# EAGLE design ten_peg_board (EAGLE 9.3.0)
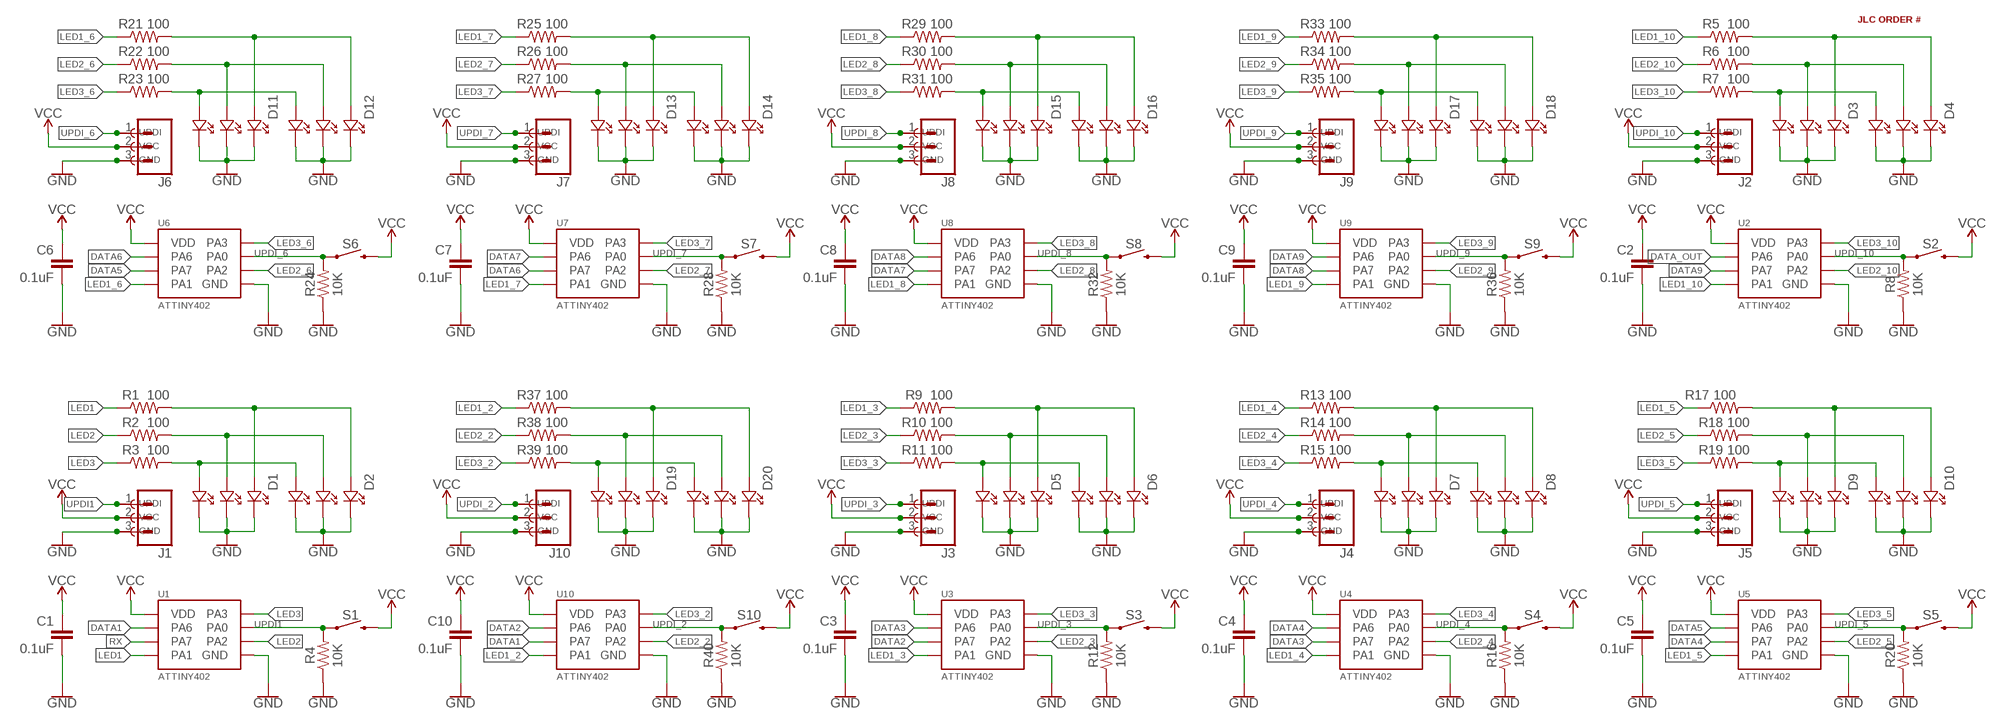
[diagram p0: schematic, sheet 1]

## Parts
C1  0.1uF  0.1UF-0603-25V-(+80/-20%)  [0603]
C2  0.1uF  0.1UF-0603-25V-(+80/-20%)  [0603]
C3  0.1uF  0.1UF-0603-25V-(+80/-20%)  [0603]
C4  0.1uF  0.1UF-0603-25V-(+80/-20%)  [0603]
C5  0.1uF  0.1UF-0603-25V-(+80/-20%)  [0603]
C6  0.1uF  0.1UF-0603-25V-(+80/-20%)  [0603]
C7  0.1uF  0.1UF-0603-25V-(+80/-20%)  [0603]
C8  0.1uF  0.1UF-0603-25V-(+80/-20%)  [0603]
C9  0.1uF  0.1UF-0603-25V-(+80/-20%)  [0603]
C10  0.1uF  0.1UF-0603-25V-(+80/-20%)  [0603]
D1  19-337C/RSBHGHC-A88/4T  [6-SMD]
D2  19-337C/RSBHGHC-A88/4T  [6-SMD]
D3  19-337C/RSBHGHC-A88/4T  [6-SMD]
D4  19-337C/RSBHGHC-A88/4T  [6-SMD]
D5  19-337C/RSBHGHC-A88/4T  [6-SMD]
D6  19-337C/RSBHGHC-A88/4T  [6-SMD]
D7  19-337C/RSBHGHC-A88/4T  [6-SMD]
D8  19-337C/RSBHGHC-A88/4T  [6-SMD]
D9  19-337C/RSBHGHC-A88/4T  [6-SMD]
D10  19-337C/RSBHGHC-A88/4T  [6-SMD]
D11  19-337C/RSBHGHC-A88/4T  [6-SMD]
D12  19-337C/RSBHGHC-A88/4T  [6-SMD]
D13  19-337C/RSBHGHC-A88/4T  [6-SMD]
D14  19-337C/RSBHGHC-A88/4T  [6-SMD]
D15  19-337C/RSBHGHC-A88/4T  [6-SMD]
D16  19-337C/RSBHGHC-A88/4T  [6-SMD]
D17  19-337C/RSBHGHC-A88/4T  [6-SMD]
D18  19-337C/RSBHGHC-A88/4T  [6-SMD]
D19  19-337C/RSBHGHC-A88/4T  [6-SMD]
D20  19-337C/RSBHGHC-A88/4T  [6-SMD]
J1  CONN_03LOCK_LONGPADS  [1X03_LOCK_LONGPADS]
J2  CONN_03LOCK_LONGPADS  [1X03_LOCK_LONGPADS]
J3  CONN_03LOCK_LONGPADS  [1X03_LOCK_LONGPADS]
J4  CONN_03LOCK_LONGPADS  [1X03_LOCK_LONGPADS]
J5  CONN_03LOCK_LONGPADS  [1X03_LOCK_LONGPADS]
J6  CONN_03LOCK_LONGPADS  [1X03_LOCK_LONGPADS]
J7  CONN_03LOCK_LONGPADS  [1X03_LOCK_LONGPADS]
J8  CONN_03LOCK_LONGPADS  [1X03_LOCK_LONGPADS]
J9  CONN_03LOCK_LONGPADS  [1X03_LOCK_LONGPADS]
J10  CONN_03LOCK_LONGPADS  [1X03_LOCK_LONGPADS]
R1  100  100OHM-0603-1/4W-5%  [0603]
R2  100  100OHM-0603-1/4W-5%  [0603]
R3  100  100OHM-0603-1/4W-5%  [0603]
R4  10K  100OHM-0603-1/4W-5%  [0603]
R5  100  100OHM-0603-1/4W-5%  [0603]
R6  100  100OHM-0603-1/4W-5%  [0603]
R7  100  100OHM-0603-1/4W-5%  [0603]
R8  10K  100OHM-0603-1/4W-5%  [0603]
R9  100  100OHM-0603-1/4W-5%  [0603]
R10  100  100OHM-0603-1/4W-5%  [0603]
R11  100  100OHM-0603-1/4W-5%  [0603]
R12  10K  100OHM-0603-1/4W-5%  [0603]
R13  100  100OHM-0603-1/4W-5%  [0603]
R14  100  100OHM-0603-1/4W-5%  [0603]
R15  100  100OHM-0603-1/4W-5%  [0603]
R16  10K  100OHM-0603-1/4W-5%  [0603]
R17  100  100OHM-0603-1/4W-5%  [0603]
R18  100  100OHM-0603-1/4W-5%  [0603]
R19  100  100OHM-0603-1/4W-5%  [0603]
R20  10K  100OHM-0603-1/4W-5%  [0603]
R21  100  100OHM-0603-1/4W-5%  [0603]
R22  100  100OHM-0603-1/4W-5%  [0603]
R23  100  100OHM-0603-1/4W-5%  [0603]
R24  10K  100OHM-0603-1/4W-5%  [0603]
R25  100  100OHM-0603-1/4W-5%  [0603]
R26  100  100OHM-0603-1/4W-5%  [0603]
R27  100  100OHM-0603-1/4W-5%  [0603]
R28  10K  100OHM-0603-1/4W-5%  [0603]
R29  100  100OHM-0603-1/4W-5%  [0603]
R30  100  100OHM-0603-1/4W-5%  [0603]
R31  100  100OHM-0603-1/4W-5%  [0603]
R32  10K  100OHM-0603-1/4W-5%  [0603]
R33  100  100OHM-0603-1/4W-5%  [0603]
R34  100  100OHM-0603-1/4W-5%  [0603]
R35  100  100OHM-0603-1/4W-5%  [0603]
R36  10K  100OHM-0603-1/4W-5%  [0603]
R37  100  100OHM-0603-1/4W-5%  [0603]
R38  100  100OHM-0603-1/4W-5%  [0603]
R39  100  100OHM-0603-1/4W-5%  [0603]
R40  10K  100OHM-0603-1/4W-5%  [0603]
S1  MOMENTARY-SWITCH-SPST-SMD-4.5MM-WINGED  [TACTILE_SWITCH_SMD_4.5MM_WINGED]
S2  MOMENTARY-SWITCH-SPST-SMD-4.5MM-WINGED  [TACTILE_SWITCH_SMD_4.5MM_WINGED]
S3  MOMENTARY-SWITCH-SPST-SMD-4.5MM-WINGED  [TACTILE_SWITCH_SMD_4.5MM_WINGED]
S4  MOMENTARY-SWITCH-SPST-SMD-4.5MM-WINGED  [TACTILE_SWITCH_SMD_4.5MM_WINGED]
S5  MOMENTARY-SWITCH-SPST-SMD-4.5MM-WINGED  [TACTILE_SWITCH_SMD_4.5MM_WINGED]
S6  MOMENTARY-SWITCH-SPST-SMD-4.5MM-WINGED  [TACTILE_SWITCH_SMD_4.5MM_WINGED]
S7  MOMENTARY-SWITCH-SPST-SMD-4.5MM-WINGED  [TACTILE_SWITCH_SMD_4.5MM_WINGED]
S8  MOMENTARY-SWITCH-SPST-SMD-4.5MM-WINGED  [TACTILE_SWITCH_SMD_4.5MM_WINGED]
S9  MOMENTARY-SWITCH-SPST-SMD-4.5MM-WINGED  [TACTILE_SWITCH_SMD_4.5MM_WINGED]
S10  MOMENTARY-SWITCH-SPST-SMD-4.5MM-WINGED  [TACTILE_SWITCH_SMD_4.5MM_WINGED]
TP1  TEST-POINT3X5  [PAD.03X.05]
TP2  TEST-POINT3X5  [PAD.03X.05]
TP3  TEST-POINT3X5  [PAD.03X.05]
TP4  TEST-POINT3X5  [PAD.03X.05]
TP5  TEST-POINT3X5  [PAD.03X.05]
TP6  TEST-POINT3X5  [PAD.03X.05]
TP7  TEST-POINT3X5  [PAD.03X.05]
TP8  TEST-POINT3X5  [PAD.03X.05]
TP9  TEST-POINT3X5  [PAD.03X.05]
TP10  TEST-POINT3X5  [PAD.03X.05]
TP11  TEST-POINT3X5  [PAD.03X.05]
TP12  TEST-POINT3X5  [PAD.03X.05]
TP13  TEST-POINT3X5  [PAD.03X.05]
TP14  TEST-POINT3X5  [PAD.03X.05]
TP15  TEST-POINT3X5  [PAD.03X.05]
TP16  TEST-POINT3X5  [PAD.03X.05]
TP17  TEST-POINT3X5  [PAD.03X.05]
TP18  TEST-POINT3X5  [PAD.03X.05]
TP19  TEST-POINT3X5  [PAD.03X.05]
TP20  TEST-POINT3X5  [PAD.03X.05]
TP21  TEST-POINT3X5  [PAD.03X.05]
TP22  TEST-POINT3X5  [PAD.03X.05]
TP23  TEST-POINT3X5  [PAD.03X.05]
TP24  TEST-POINT3X5  [PAD.03X.05]
TP25  TEST-POINT3X5  [PAD.03X.05]
TP26  TEST-POINT3X5  [PAD.03X.05]
TP27  TEST-POINT3X5  [PAD.03X.05]
TP28  TEST-POINT3X5  [PAD.03X.05]
TP29  TEST-POINT3X5  [PAD.03X.05]
TP30  TEST-POINT3X5  [PAD.03X.05]
U1  ATTINY402  [8-SOIC]
U2  ATTINY402  [8-SOIC]
U3  ATTINY402  [8-SOIC]
U4  ATTINY402  [8-SOIC]
U5  ATTINY402  [8-SOIC]
U6  ATTINY402  [8-SOIC]
U7  ATTINY402  [8-SOIC]
U8  ATTINY402  [8-SOIC]
U9  ATTINY402  [8-SOIC]
U10  ATTINY402  [8-SOIC]
U$1  JLC-ORDER-NUMBER  [JLC_ORDER_NUMBER]

## Nets
DATA1: U1.P$2(PA6) U10.P$3(PA7)
DATA2: U3.P$3(PA7) U10.P$2(PA6)
DATA3: U3.P$2(PA6) U4.P$3(PA7)
DATA4: U4.P$2(PA6) U5.P$3(PA7)
DATA5: U5.P$2(PA6) U6.P$3(PA7)
DATA6: U6.P$2(PA6) U7.P$3(PA7)
DATA7: U7.P$2(PA6) U8.P$3(PA7)
DATA8: U8.P$2(PA6) U9.P$3(PA7)
DATA9: U2.P$3(PA7) U9.P$2(PA6)
DATA_OUT: U2.P$2(PA6)
GND: C1.2 C2.2 C3.2 C4.2 C5.2 C6.2 C7.2 C8.2 C9.2 C10.2 D1.P$1 D1.P$3 D1.P$5 D2.P$1 D2.P$3 D2.P$5 D3.P$1 D3.P$3 D3.P$5 D4.P$1 D4.P$3 D4.P$5 D5.P$1 D5.P$3 D5.P$5 D6.P$1 D6.P$3 D6.P$5 D7.P$1 D7.P$3 D7.P$5 D8.P$1 D8.P$3 D8.P$5 D9.P$1 D9.P$3 D9.P$5 D10.P$1 D10.P$3 D10.P$5 D11.P$1 D11.P$3 D11.P$5 D12.P$1 D12.P$3 D12.P$5 D13.P$1 D13.P$3 D13.P$5 D14.P$1 D14.P$3 D14.P$5 D15.P$1 D15.P$3 D15.P$5 D16.P$1 D16.P$3 D16.P$5 D17.P$1 D17.P$3 D17.P$5 D18.P$1 D18.P$3 D18.P$5 D19.P$1 D19.P$3 D19.P$5 D20.P$1 D20.P$3 D20.P$5 J1.3 J2.3 J3.3 J4.3 J5.3 J6.3 J7.3 J8.3 J9.3 J10.3 R4.1 R8.1 R12.1 R16.1 R20.1 R24.1 R28.1 R32.1 R36.1 R40.1 TP3.P$1 TP6.P$1 TP9.P$1 TP12.P$1 TP15.P$1 TP18.P$1 TP21.P$1 TP24.P$1 TP27.P$1 TP30.P$1 U1.P$8(GND) U2.P$8(GND) U3.P$8(GND) U4.P$8(GND) U5.P$8(GND) U6.P$8(GND) U7.P$8(GND) U8.P$8(GND) U9.P$8(GND) U10.P$8(GND)
LED1: R1.1 U1.P$4(PA1)
LED1_2: R37.1 U10.P$4(PA1)
LED1_3: R9.1 U3.P$4(PA1)
LED1_4: R13.1 U4.P$4(PA1)
LED1_5: R17.1 U5.P$4(PA1)
LED1_6: R21.1 U6.P$4(PA1)
LED1_7: R25.1 U7.P$4(PA1)
LED1_8: R29.1 U8.P$4(PA1)
LED1_9: R33.1 U9.P$4(PA1)
LED1_10: R5.1 U2.P$4(PA1)
LED2: R2.1 U1.P$5(PA2)
LED2_2: R38.1 U10.P$5(PA2)
LED2_3: R10.1 U3.P$5(PA2)
LED2_4: R14.1 U4.P$5(PA2)
LED2_5: R18.1 U5.P$5(PA2)
LED2_6: R22.1 U6.P$5(PA2)
LED2_7: R26.1 U7.P$5(PA2)
LED2_8: R30.1 U8.P$5(PA2)
LED2_9: R34.1 U9.P$5(PA2)
LED2_10: R6.1 U2.P$5(PA2)
LED3: R3.1 U1.P$7(PA3)
LED3_2: R39.1 U10.P$7(PA3)
LED3_3: R11.1 U3.P$7(PA3)
LED3_4: R15.1 U4.P$7(PA3)
LED3_5: R19.1 U5.P$7(PA3)
LED3_6: R23.1 U6.P$7(PA3)
LED3_7: R27.1 U7.P$7(PA3)
LED3_8: R31.1 U8.P$7(PA3)
LED3_9: R35.1 U9.P$7(PA3)
LED3_10: R7.1 U2.P$7(PA3)
N$1: D3.P$6 D4.P$6 R7.2
N$2: D3.P$4 D4.P$4 R6.2
N$3: D3.P$2 D4.P$2 R5.2
N$4: D5.P$6 D6.P$6 R11.2
N$5: D5.P$4 D6.P$4 R10.2
N$6: D5.P$2 D6.P$2 R9.2
N$7: D7.P$6 D8.P$6 R15.2
N$8: D7.P$4 D8.P$4 R14.2
N$9: D7.P$2 D8.P$2 R13.2
N$10: D9.P$6 D10.P$6 R19.2
N$11: D9.P$4 D10.P$4 R18.2
N$12: D9.P$2 D10.P$2 R17.2
N$13: D1.P$6 D2.P$6 R3.2
N$14: D1.P$4 D2.P$4 R2.2
N$15: D1.P$2 D2.P$2 R1.2
N$16: D11.P$6 D12.P$6 R23.2
N$17: D11.P$4 D12.P$4 R22.2
N$18: D11.P$2 D12.P$2 R21.2
N$19: D13.P$6 D14.P$6 R27.2
N$20: D13.P$4 D14.P$4 R26.2
N$21: D13.P$2 D14.P$2 R25.2
N$22: D15.P$6 D16.P$6 R31.2
N$23: D15.P$4 D16.P$4 R30.2
N$24: D15.P$2 D16.P$2 R29.2
N$25: D17.P$6 D18.P$6 R35.2
N$26: D17.P$4 D18.P$4 R34.2
N$27: D17.P$2 D18.P$2 R33.2
N$28: D19.P$6 D20.P$6 R39.2
N$29: D19.P$4 D20.P$4 R38.2
N$30: D19.P$2 D20.P$2 R37.2
RX: U1.P$3(PA7)
UPDI1: J1.1 R4.2 S1.2 S1.3 TP25.P$1 U1.P$6(PA0)
UPDI_2: J10.1 R40.2 S10.2 S10.3 TP22.P$1 U10.P$6(PA0)
UPDI_3: J3.1 R12.2 S3.2 S3.3 TP19.P$1 U3.P$6(PA0)
UPDI_4: J4.1 R16.2 S4.2 S4.3 TP16.P$1 U4.P$6(PA0)
UPDI_5: J5.1 R20.2 S5.2 S5.3 TP13.P$1 U5.P$6(PA0)
UPDI_6: J6.1 R24.2 S6.2 S6.3 TP10.P$1 U6.P$6(PA0)
UPDI_7: J7.1 R28.2 S7.2 S7.3 TP7.P$1 U7.P$6(PA0)
UPDI_8: J8.1 R32.2 S8.2 S8.3 TP4.P$1 U8.P$6(PA0)
UPDI_9: J9.1 R36.2 S9.2 S9.3 TP28.P$1 U9.P$6(PA0)
UPDI_10: J2.1 R8.2 S2.2 S2.3 TP1.P$1 U2.P$6(PA0)
VCC: C1.1 C2.1 C3.1 C4.1 C5.1 C6.1 C7.1 C8.1 C9.1 C10.1 J1.2 J2.2 J3.2 J4.2 J5.2 J6.2 J7.2 J8.2 J9.2 J10.2 S1.1 S1.4 S2.1 S2.4 S3.1 S3.4 S4.1 S4.4 S5.1 S5.4 S6.1 S6.4 S7.1 S7.4 S8.1 S8.4 S9.1 S9.4 S10.1 S10.4 TP2.P$1 TP5.P$1 TP8.P$1 TP11.P$1 TP14.P$1 TP17.P$1 TP20.P$1 TP23.P$1 TP26.P$1 TP29.P$1 U1.P$1(VDD) U2.P$1(VDD) U3.P$1(VDD) U4.P$1(VDD) U5.P$1(VDD) U6.P$1(VDD) U7.P$1(VDD) U8.P$1(VDD) U9.P$1(VDD) U10.P$1(VDD)

## Notes on the sheet
- UPDI | UPDI | UPDI | UPDI | UPDI
- VCC | VCC | VCC | VCC | VCC
- GND | GND | GND | GND | GND
- UPDI | UPDI | UPDI | UPDI | UPDI
- VCC | VCC | VCC | VCC | VCC
- GND | GND | GND | GND | GND

## Library data of the parts
C1-C10 = SparkFun-Capacitors:0.1UF: 0.1µF ceramic capacitors A capacitor is a passive two-terminal electrical component used to store electrical energy temporarily in an electric field.; PROD_ID: CAP-00810
D1-D20 = IDEO-Diodes:19-337C/RSBHGHC-A88/4T
J1-J10 = SparkFun-Connectors:CONN_03: Multi connection point. Often used as Generic Header-pin footprint for 0.1 inch spaced/style header connections On any of the 0.1 inch spaced packages, you can populate with these: Break Away Headers - Straight <https://www.sparkfun.com/products/116> (PRT-00116) Break Away Male Headers - Right Angle <https://www.sparkfun.com/products/553> (PRT-00553) Female Headers <https://www.sparkfun.com/products/115> (PRT-00115) Break Away Headers - Machine Pin <https://www.sparkfun.com/products/117> (PRT-00117) Break Away Female Headers - Swiss Machine Pin <https://www.sparkfun.com/products/743> (PRT-00743) Stackable Header - 3 Pin (Female, 0.1") <https://www.sparkfun.com/products/13875> (PRT-13875) For SCREWTERMINALS and SPRING TERMINALS visit here: Screw Terimnals on SparkFun.com <https://www.sparkfun.com/search/results?term=Screw+Terminals> (5mm/3.5mm/2.54mm spacing) This device is also useful as a general connection point to wire up your design to another part of your project. Our various solder wires solder well into these plated through hole pads. Hook-Up Wire - Assortment (Stranded, 22 AWG) <https://www.sparkfun.com/products/11375> (PRT-11375) Hook-Up Wire - Assortment (Solid Core, 22 AWG) <https://www.sparkfun.com/products/11367> (PRT-11367) View the entire wire category on our website here <https://www.sparkfun.com/categories/141> Special notes: Molex polarized connector foot print use with SKU : PRT-08232 with associated crimp pins and housings.
R1-R3 R5-R7 R9-R11 R13-R15 R17-R19 R21-R23 R25-R27 R29-R31 R33-R35 R37-R39 = SparkFun-Resistors:100OHM: 100Ω resistor A resistor is a passive two-terminal electrical component that implements electrical resistance as a circuit element. Resistors act to reduce current flow, and, at the same time, act to lower voltage levels within circuits. - Wikipedia; PROD_ID: RES-12438
R4 R8 R12 R16 R20 R24 R28 R32 R36 R40 = SparkFun-Resistors:100OHM: 100Ω resistor A resistor is a passive two-terminal electrical component that implements electrical resistance as a circuit element. Resistors act to reduce current flow, and, at the same time, act to lower voltage levels within circuits. - Wikipedia; PROD_ID: RES-12438; VALUE: 100
S1-S10 = SparkFun-Switches:MOMENTARY-SWITCH-SPST: Momentary Switch (Pushbutton) - SPST Normally-open (NO) SPST momentary switches (buttons, pushbuttons). Variants PTH-12MM - 12mm square, through-hole Momentary Pushbutton Switch - 12mm Square <https://www.sparkfun.com/products/9190> (COM-09190) PTH-6.0MM, PTH-6.0MM-KIT - 6.0mm square, through-hole Mini Pushbutton Switch <https://www.sparkfun.com/products/97> (COM-00097) KIT package intended for soldering kit's - only one side of pads' copper is exposed. PTH-RIGHT-ANGLE-KIT - Right-angle, through-hole Right Angle Tactile Button <https://www.sparkfun.com/products/10791> - Used on SparkFun BigTime Watch Kit <https://www.sparkfun.com/products/11734> SMD-12MM - 12mm square, surface-mount Tactile Button - SMD (12mm) <https://www.sparkfun.com/products/12993> (COM-12993) Used on SparkFun PicoBoard <https://www.sparkfun.com/products/11888> SMD-4.5MM - 4.5mm Square Trackball Switch Used on SparkFun Blackberry Trackballer Breakout <https://www.sparkfun.com/products/13169> SMD-4.6MMX2.8MM - 4.60mm x 2.80mm, surface mount Used on SparkFun SAMD21 Mini Breakout <https://www.sparkfun.com/products/13664> SMD-5.2MM, SMD-5.2-REDUNDANT - 5.2mm square, surface-mount Mini Pushbutton Switch - SMD <https://www.sparkfun.com/products/8720> (COM-08720) Used on Arduino Pro Mini <https://www.sparkfun.com/products/11114> REDUNDANT package connects both switch circuits together SMD-6.0X3.5MM - 6.0 x 3.5mm, surface mount Momentary Reset Switch SMD <https://www.sparkfun.com/products/8229> (COM-08229) SMD-6.2MM-TALL - 6.2mm square, surface mount Tactile Button - SMD (6mm) <https://www.sparkfun.com/products/12992> Used on SparkFun Digital Sandbox <https://www.sparkfun.com/products/12651> SMD-RIGHT-ANGLE - Right-angle, surface mount Used on SparkFun Block for Intel® Edison - Arduino <https://www.sparkfun.com/products/13036>
TP1-TP30 = SparkFun-Connectors:TEST-POINT: SparkFun Test Points Bare copper test points for troubleshooting or In-Circuit-Testing. These are used by our Production team for verifying production board runs using pogo-pins on test beds. SparkFun Products: SparkFun LSM9DS1 Breakout <https://www.sparkfun.com/products/13284> SparkFun PSOC <https://www.sparkfun.com/products/13714> SparkFun Load Cell Amplifier <https://www.sparkfun.com/products/13879>
U1-U10 = IDEO-ICs:ATTINY402
U$1 = IDEO-Misc:JLC-ORDER-NUMBER

## Board
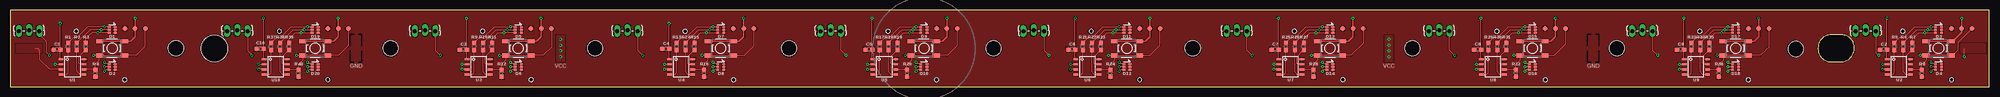
[diagram p1: board, top side]
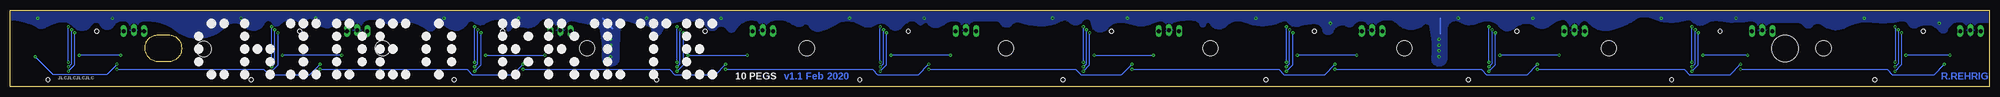
[diagram p2: board, bottom side, seen from below]

Size 492 x 19.05 mm. Coordinates in mm from the lower left corner, seen from the top.
Outline: 0,0 492,0 492,19.05 0,19.05 0,0
Outline: 452.56,12.88 arc90 449.38,9.7 449.38,9.38 arc90 452.56,6.21 455.1,6.21 arc90 458.43,9.54 458.43,9.7 arc90 455.26,12.88 452.56,12.88
Copper layers (1*16): Top 0.035mm / dielectric 1.5mm / Bottom 0.035mm
Design rules "standard_rob": minimum track width 7mil, minimum drill 12mil, track to track 7mil, track to pad 7mil, pad to pad 7mil, via to via 7mil, smd to smd 7mil, copper to edge 10mil, drill to drill 8mil, minimum pad ring 10mil, minimum via ring 8mil, stop-mask expansion 4mil, vias tented up to drill 12mil, thermal gap 10mil
Holes 6.6 mm at 50.76,9.54
Holes 1.02 mm at 369.53,13.83 381.6,1.76 331.27,1.76 319.21,13.83 268.73,13.83 280.79,1.76 218.24,13.83 230.31,1.76 167.76,13.83 179.83,1.76 117.44,13.83 129.5,1.76 66.95,13.83 79.02,1.76 16.47,13.83 28.54,1.76 420.01,13.83 432.08,1.76 470.5,13.83 482.56,1.76
Holes 3.81 mm at 41.24,9.54 94.58,9.54 145.38,9.54 193.64,9.54 244.44,9.54 293.97,9.54 348.58,9.54 399.38,9.54 443.83,9.38
tRestrict: 16 lines

### Footprints (pad centres in the part's own frame; a part is rotated, then mirrored left to right if it is on the bottom)
0603 = smd 1.1 x 1: 1 -0.85,0; 2 0.85,0
6-SMD = smd 0.7 x 0.4: P$1 0.75,0.725; P$2 -0.75,0.725; P$5 0.75,-0.725; P$6 -0.75,-0.725 | smd 0.7 x 0.5: P$3 0.75,0; P$4 -0.75,0
1X03_LOCK_LONGPADS = drill 1.016 long: 1 0,0; 2 2.54,-0.254; 3 5.08,0
TACTILE_SWITCH_SMD_4.5MM_WINGED = smd 1.8 x 1.1: 1 3.1,1.75; 2 3.1,-1.75; 3 -3.1,-1.75; 4 -3.1,1.75
PAD.03X.05 = smd 1.27 x 1.27: P$1 0,0
8-SOIC = smd 0.55 x 1.2: P$1 -1.905,-2.87; P$2 -0.635,-2.87; P$3 0.635,-2.87; P$4 1.905,-2.87; P$5 1.905,2.87; P$6 0.635,2.87; P$7 -0.635,2.87; P$8 -1.905,2.87

### Placement (x,y rotation side)
C1  11.71,9.23 180 top
C2  465.69,9.23 180 top
C3  112.67,9.23 180 top
C4  163,9.38 180 top
C5  213.48,9.23 180 top
C6  263.96,9.23 180 top
C7  314.45,9.23 180 top
C8  364.77,9.23 180 top
C9  415.25,9.23 180 top
C10  62.19,9.38 180 top
D1  25.36,14.15 0 top
D2  25.36,4.94 0 top
D3  479.34,14.15 0 top
D4  479.34,4.94 0 top
D5  126.33,14.15 0 top
D6  126.33,4.94 0 top
D7  176.65,14.15 0 top
D8  176.65,4.94 0 top
D9  227.13,14.15 0 top
D10  227.13,4.94 0 top
D11  277.62,14.15 0 top
D12  277.62,4.94 0 top
D13  328.1,14.15 0 top
D14  328.1,4.94 0 top
D15  378.42,14.15 0 top
D16  378.42,4.94 0 top
D17  428.9,14.15 0 top
D18  428.9,4.94 0 top
D19  75.84,14.15 0 top
D20  75.84,4.94 0 top
J1  7.26,13.83 180 top
J2  463.79,13.83 180 top
J3  105.69,13.83 180 top
J4  156.01,13.83 180 top
J5  206.5,13.83 180 top
J6  256.98,13.83 180 top
J7  307.46,13.83 180 top
J8  357.78,13.83 180 top
J9  408.27,13.83 180 top
J10  59.02,13.83 180 top
R1  14.41,10.02 90 top
R2  16.63,10.02 90 top
R3  18.85,10.02 90 top
R4  21.23,3.35 90 top
R5  468.39,10.02 90 top
R6  470.61,10.02 90 top
R7  472.84,10.02 90 top
R8  475.22,3.35 90 top
R9  115.37,10.02 90 top
R10  117.6,10.02 90 top
R11  119.82,10.02 90 top
R12  122.2,3.35 90 top
R13  165.7,10.02 90 top
R14  167.92,10.02 90 top
R15  170.14,10.02 90 top
R16  172.52,3.35 90 top
R17  216.18,10.02 90 top
R18  218.4,10.02 90 top
R19  220.62,10.02 90 top
R20  223.01,3.35 90 top
R21  266.66,10.02 90 top
R22  268.88,10.02 90 top
R23  271.11,10.02 90 top
R24  273.49,3.35 90 top
R25  317.14,10.02 90 top
R26  319.37,10.02 90 top
R27  321.59,10.02 90 top
R28  323.97,3.35 90 top
R29  367.47,10.02 90 top
R30  369.69,10.02 90 top
R31  371.91,10.02 90 top
R32  374.29,3.35 90 top
R33  417.95,10.02 90 top
R34  420.17,10.02 90 top
R35  422.4,10.02 90 top
R36  424.78,3.35 90 top
R37  64.89,10.02 90 top
R38  67.11,10.02 90 top
R39  69.34,10.02 90 top
R40  71.72,3.35 90 top
S1  25.36,9.54 0 top
S2  479.34,9.54 0 top
S3  126.33,9.54 0 top
S4  176.65,9.54 0 top
S5  227.13,9.54 0 top
S6  277.62,9.54 0 top
S7  328.1,9.54 0 top
S8  378.42,9.54 0 top
S9  428.9,9.54 0 top
S10  75.84,9.54 0 top
TP1  487.64,14.46 90 top
TP2  485.1,14.46 90 top
TP3  482.56,14.46 90 top
TP4  386.68,14.46 90 top
TP5  384.14,14.46 90 top
TP6  381.6,14.46 90 top
TP7  336.35,14.46 0 top
TP8  333.81,14.46 0 top
TP9  331.27,14.46 0 top
TP10  285.87,14.46 90 top
TP11  283.33,14.46 90 top
TP12  280.79,14.46 90 top
TP13  235.39,14.46 90 top
TP14  232.85,14.46 90 top
TP15  230.31,14.46 90 top
TP16  184.91,14.46 90 top
TP17  182.37,14.46 90 top
TP18  179.83,14.46 90 top
TP19  134.58,14.46 90 top
TP20  132.04,14.46 90 top
TP21  129.5,14.46 90 top
TP22  84.1,14.46 90 top
TP23  81.56,14.46 90 top
TP24  79.02,14.46 90 top
TP25  33.62,14.46 90 top
TP26  31.08,14.46 90 top
TP27  28.54,14.46 90 top
TP28  437.16,14.46 90 top
TP29  434.62,14.46 90 top
TP30  432.08,14.46 90 top
U1  15.52,4.94 270 top
U2  469.5,4.94 270 top
U3  116.48,4.94 270 top
U4  166.81,4.94 270 top
U5  217.29,4.94 270 top
U6  267.77,4.94 270 top
U7  318.26,4.94 270 top
U8  368.58,4.94 270 top
U9  419.06,4.94 270 top
U10  66,4.94 270 top
U$1  475.58,1.76 0 bottom

### Tracks (layer width: path | path; a pad name or v marks a point on that pad's centre or on a via)
DATA1  (via drill 0.3)
  Top 0.178: v11.23,5.57 U1.P$2 | U10.P$3 v61.87,4.3
  Bottom 0.178: v11.23,5.57 13.77,3.03 24.09,3.03 25.36,4.3 v61.87,4.3
DATA2  (via drill 0.3)
  Top 0.178: U3.P$3 v112.36,4.3 | v61.87,5.57 U10.P$2
  Bottom 0.178: v112.36,4.3 75.84,4.3 74.57,3.03 64.41,3.03 v61.87,5.57
DATA3  (via drill 0.3)
  Top 0.178: U4.P$3 v162.68,4.3 | v112.36,5.57 U3.P$2
  Bottom 0.178: v162.68,4.3 126.33,4.3 125.06,3.03 114.9,3.03 v112.36,5.57
DATA4  (via drill 0.3)
  Top 0.178: v162.68,5.57 U4.P$2 | U5.P$3 v213.16,4.3
  Bottom 0.178: v213.16,4.3 176.65,4.3 175.38,3.03 165.22,3.03 v162.68,5.57
DATA5  (via drill 0.3)
  Top 0.178: U6.P$3 v263.65,4.3 | v213.16,5.57 U5.P$2
  Bottom 0.178: v263.65,4.3 227.13,4.3 225.86,3.03 215.7,3.03 v213.16,5.57
DATA6  (via drill 0.3)
  Top 0.178: U7.P$3 v314.13,4.3 | v263.65,5.57 U6.P$2
  Bottom 0.178: v314.13,4.3 277.62,4.3 276.35,3.03 266.19,3.03 v263.65,5.57
DATA7  (via drill 0.3)
  Top 0.178: v314.13,5.57 U7.P$2 | U8.P$3 v364.45,4.3
  Bottom 0.178: v364.45,4.3 328.1,4.3 326.83,3.03 316.67,3.03 v314.13,5.57
DATA8  (via drill 0.3)
  Top 0.178: v364.45,5.57 U8.P$2 | U9.P$3 v414.93,4.3
  Bottom 0.178: v414.93,4.3 378.42,4.3 377.15,3.03 366.99,3.03 v364.45,5.57
DATA9  (via drill 0.3)
  Top 0.178: v414.93,5.57 U9.P$2 | U2.P$3 v465.42,4.3
  Bottom 0.178: v465.42,4.3 428.9,4.3 427.63,3.03 417.47,3.03 v414.93,5.57
DATA_OUT  (via drill 0.3)
  Top 0.178: U2.P$2 v465.42,5.57 | v485.74,7.48 485.74,9.38
  Bottom 0.178: v465.42,5.57 467.96,3.03 481.29,3.03 v485.74,7.48
  pour Top: 484.78,10.65 484.78,8.43 491.13,8.43 491.13,10.65
GND
  pour Top (rank 3): -0.36,19.54 -0.36,-0.78 492.56,-0.78 492.56,19.54
  pour Top (rank 2): 84.89,12.72 84.89,6.37 87.12,6.37 87.12,12.72
  pour Top: 392.39,12.72 392.39,6.37 394.61,6.37 394.61,12.72
LED1
  Top 0.178: U1.P$4 13.93,3.03 14.41,3.51 R1.1
LED1_2
  Top 0.178: U10.P$4 64.41,3.03 64.89,3.51 R37.1
LED1_3
  Top 0.178: U3.P$4 114.9,3.03 115.37,3.51 R9.1
LED1_4
  Top 0.178: U4.P$4 165.22,3.03 165.7,3.51 R13.1
LED1_5
  Top 0.178: U5.P$4 215.7,3.03 216.18,3.51 R17.1
LED1_6
  Top 0.178: U6.P$4 266.19,3.03 266.66,3.51 R21.1
LED1_7
  Top 0.178: U7.P$4 316.67,3.03 317.14,3.51 R25.1
LED1_8
  Top 0.178: U8.P$4 366.99,3.03 367.47,3.51 R29.1
LED1_9
  Top 0.178: U9.P$4 417.47,3.03 417.95,3.51 R33.1
LED1_10
  Top 0.178: U2.P$4 467.96,3.03 468.39,3.47 R5.1
LED2
  Top 0.178: U1.P$5 17.42,3.03 16.63,3.83 R2.1
LED2_2
  Top 0.178: U10.P$5 67.75,3.03 67.11,3.67 R38.1
LED2_3
  Top 0.178: U3.P$5 118.23,3.03 117.6,3.67 R10.1
LED2_4
  Top 0.178: U4.P$5 168.55,3.03 167.92,3.67 R14.1
LED2_5
  Top 0.178: U5.P$5 219.04,3.03 218.4,3.67 R18.1
LED2_6
  Top 0.178: U6.P$5 269.52,3.03 268.88,3.67 R22.1
LED2_7
  Top 0.178: U7.P$5 320,3.03 319.37,3.67 R26.1
LED2_8
  Top 0.178: U8.P$5 370.33,3.03 369.69,3.67 R30.1
LED2_9
  Top 0.178: U9.P$5 420.81,3.03 420.17,3.67 R34.1
LED2_10
  Top 0.178: U2.P$5 471.29,3.03 470.61,3.71 R6.1
LED3
  Top 0.178: U1.P$7 17.42,5.57 17.11,5.89 17.11,7.42 R3.1
LED3_2
  Top 0.178: U10.P$7 67.91,5.57 67.59,5.89 67.59,7.42 R39.1
LED3_3
  Top 0.178: U3.P$7 118.39,5.57 118.07,5.89 118.07,7.42 R11.1
LED3_4
  Top 0.178: U4.P$7 168.71,5.57 168.4,5.89 168.4,7.42 R15.1
LED3_5
  Top 0.178: U5.P$7 219.2,5.57 218.88,5.89 218.88,7.42 R19.1
LED3_6
  Top 0.178: U6.P$7 269.68,5.57 269.36,5.89 269.36,7.42 R23.1
LED3_7
  Top 0.178: U7.P$7 320.16,5.57 319.84,5.89 319.84,7.48 321.53,9.17 R27.1
LED3_8
  Top 0.178: U8.P$7 370.48,5.57 370.17,5.89 370.17,6.84 370.17,7.42 R31.1
LED3_9
  Top 0.178: U9.P$7 420.97,5.57 420.65,5.89 420.65,7.42 R35.1
LED3_10
  Top 0.178: U2.P$7 471.45,5.57 471.13,5.89 471.13,7.46 R7.1
N$1  (via drill 0.3)
  Top 0.178: R7.2 472.84,11.88 474.38,13.42 v475.89,13.42 D3.P$6 | D4.P$6 477.87,4.21 v477.48,3.83
  Bottom 0.178: v477.48,3.83 475.89,5.41 v475.89,13.42
N$2  (via drill 0.3)
  Top 0.178: R6.2 473.89,14.15 v476.69,14.15 D3.P$4 | D4.P$4 v477.48,4.94
  Bottom 0.178: v476.69,14.15 476.69,5.73 v477.48,4.94
N$3  (via drill 0.3)
  Top 0.178: R5.2 469.76,12.24 470.81,12.24 473.44,14.87 v477.48,14.87 D3.P$2 | D4.P$2 477.87,5.66 v477.48,6.05
  Bottom 0.178: v477.48,6.05 v477.48,14.87
N$4  (via drill 0.3)
  Top 0.178: R11.2 119.82,11.92 121.32,13.42 v122.83,13.42 D5.P$6 | D6.P$6 124.81,4.21 v124.42,3.83
  Bottom 0.178: v124.42,3.83 122.83,5.41 v122.83,13.42
N$5  (via drill 0.3)
  Top 0.178: R10.2 120.87,14.15 v123.63,14.15 D5.P$4 | D6.P$4 v124.42,4.94
  Bottom 0.178: v124.42,4.94 123.63,5.73 v123.63,14.15
N$6  (via drill 0.3)
  Top 0.178: R9.2 116.75,12.24 117.75,12.24 120.38,14.87 v124.42,14.87 D5.P$2 | D6.P$2 124.81,5.66 v124.42,6.05
  Bottom 0.178: v124.42,6.05 v124.42,14.87
N$7  (via drill 0.3)
  Top 0.178: R15.2 170.14,11.92 171.64,13.42 v173.16,13.42 D7.P$6 | D8.P$6 175.13,4.21 v174.75,3.83
  Bottom 0.178: v174.75,3.83 173.16,5.41 v173.16,13.42
N$8  (via drill 0.3)
  Top 0.178: R14.2 171.2,14.15 v173.95,14.15 D7.P$4 | D8.P$4 v174.75,4.94
  Bottom 0.178: v173.95,14.15 173.95,5.73 v174.75,4.94
N$9  (via drill 0.3)
  Top 0.178: R13.2 167.07,12.24 168.08,12.24 170.71,14.87 v174.75,14.87 D7.P$2 | D8.P$2 175.13,5.66 v174.75,6.05
  Bottom 0.178: v174.75,6.05 v174.75,14.87
N$10  (via drill 0.3)
  Top 0.178: R19.2 220.62,11.92 222.12,13.42 v223.64,13.42 D9.P$6 | D10.P$6 225.61,4.21 v225.23,3.83
  Bottom 0.178: v225.23,3.83 223.64,5.41 v223.64,13.42
N$11  (via drill 0.3)
  Top 0.178: R18.2 221.68,14.15 v224.43,14.15 D9.P$4 | D10.P$4 v225.23,4.94
  Bottom 0.178: v225.23,4.94 224.43,5.73 v224.43,14.15
N$12  (via drill 0.3)
  Top 0.178: R17.2 217.55,12.24 218.56,12.24 221.19,14.87 v225.23,14.87 D9.P$2 | D10.P$2 225.61,5.66 v225.23,6.05
  Bottom 0.178: v225.23,6.05 v225.23,14.87
N$13  (via drill 0.3)
  Top 0.178: R3.2 18.85,11.98 20.29,13.42 v21.87,13.42 D1.P$6 | D2.P$6 23.84,4.21 v23.46,3.83
  Bottom 0.178: v21.87,13.42 21.87,5.41 v23.46,3.83
N$14  (via drill 0.3)
  Top 0.178: R2.2 19.91,14.15 v22.66,14.15 D1.P$4 | D2.P$4 v23.46,4.94
  Bottom 0.178: v23.46,4.94 22.66,5.73 v22.66,14.15
N$15  (via drill 0.3)
  Top 0.178: R1.2 15.68,12.14 16.63,12.14 19.36,14.87 v23.46,14.87 D1.P$2 | D2.P$2 23.84,5.66 v23.46,6.05
  Bottom 0.178: v23.46,14.87 v23.46,6.05
N$16  (via drill 0.3)
  Top 0.178: D12.P$6 276.1,4.21 v275.71,3.83 | R23.2 271.11,11.92 272.6,13.42 v274.12,13.42 D11.P$6
  Bottom 0.178: v275.71,3.83 274.12,5.41 v274.12,13.42
N$17  (via drill 0.3)
  Top 0.178: R22.2 272.16,14.15 v274.92,14.15 D11.P$4 | D12.P$4 v275.71,4.94
  Bottom 0.178: v274.92,14.15 274.92,5.73 v275.71,4.94
N$18  (via drill 0.3)
  Top 0.178: R21.2 268.03,12.24 269.04,12.24 271.67,14.87 v275.71,14.87 D11.P$2 | D12.P$2 276.1,5.66 v275.71,6.05
  Bottom 0.178: v275.71,6.05 v275.71,14.87
N$19  (via drill 0.3)
  Top 0.178: R27.2 321.59,11.92 323.09,13.42 v324.61,13.42 D13.P$6 | D14.P$6 326.58,4.21 v326.19,3.83
  Bottom 0.178: v326.19,3.83 324.61,5.41 v324.61,13.42
N$20  (via drill 0.3)
  Top 0.178: R26.2 322.64,14.15 v325.4,14.15 D13.P$4 | D14.P$4 v326.19,4.94
  Bottom 0.178: v325.4,14.15 325.4,5.73 v326.19,4.94
N$21  (via drill 0.3)
  Top 0.178: R25.2 318.52,12.24 319.53,12.24 322.16,14.87 v326.19,14.87 D13.P$2 | D14.P$2 326.58,5.66 v326.19,6.05
  Bottom 0.178: v326.19,6.05 v326.19,14.87
N$22  (via drill 0.3)
  Top 0.178: R31.2 371.91,11.92 373.41,13.42 v374.93,13.42 D15.P$6 | D16.P$6 376.9,4.21 v376.52,3.83
  Bottom 0.178: v376.52,3.83 374.93,5.41 v374.93,13.42
N$23  (via drill 0.3)
  Top 0.178: R30.2 372.97,14.15 v375.72,14.15 D15.P$4 | D16.P$4 v376.52,4.94
  Bottom 0.178: v375.72,14.15 375.72,5.73 v376.52,4.94
N$24  (via drill 0.3)
  Top 0.178: R29.2 368.84,12.24 369.85,12.24 372.48,14.87 v376.52,14.87 D15.P$2 | D16.P$2 376.9,5.66 v376.52,6.05
  Bottom 0.178: v376.52,6.05 v376.52,14.87
N$25  (via drill 0.3)
  Top 0.178: D18.P$6 427.39,4.21 v427,3.83 | R35.2 422.4,11.92 423.89,13.42 v425.41,13.42 D17.P$6
  Bottom 0.178: v427,3.83 425.41,5.41 v425.41,13.42
N$26  (via drill 0.3)
  Top 0.178: R34.2 423.45,14.15 v426.21,14.15 D17.P$4 | D18.P$4 v427,4.94
  Bottom 0.178: v426.21,14.15 426.21,5.73 v427,4.94
N$27  (via drill 0.3)
  Top 0.178: R33.2 419.32,12.24 420.33,12.24 422.96,14.87 v427,14.87 D17.P$2 | D18.P$2 427.39,5.66 v427,6.05
  Bottom 0.178: v427,6.05 v427,14.87
N$28  (via drill 0.3)
  Top 0.178: R39.2 69.34,11.92 70.83,13.42 v72.35,13.42 D19.P$6 | D20.P$6 74.33,4.21 v73.94,3.83
  Bottom 0.178: v73.94,3.83 72.35,5.41 v72.35,13.42
N$29  (via drill 0.3)
  Top 0.178: R38.2 70.39,14.15 v73.15,14.15 D19.P$4 | D20.P$4 v73.94,4.94
  Bottom 0.178: v73.15,14.15 73.15,5.73 v73.94,4.94
N$30  (via drill 0.3)
  Top 0.178: R37.2 66.26,12.24 67.27,12.24 69.9,14.87 v73.94,14.87 D19.P$2 | D20.P$2 74.33,5.66 v73.94,6.05
  Bottom 0.178: v73.94,6.05 v73.94,14.87
RX
  Top 0.178: U1.P$3 9.8,4.3 7.42,6.68 7.42,8.91 6.95,9.38 6.31,9.38
  pour Top: 1.87,10.65 7.9,10.65 7.9,8.43 1.55,8.43 1.55,10.65
UPDI1  (via drill 0.3)
  Top 0.178: 21.08,4.3 21.08,5.41 22.19,6.53 22.19,7.79 22.18,7.8 v20.76,7.8 | 21.08,4.3 U1.P$6 | S1.3 S1.2 31.39,7.79 33.62,10.02 TP25.P$1 | 21.08,4.3 21.18,4.2 R4.2 | J1.1 7.26,13.03 9.01,11.29 9.01,8.59 v9.8,7.8
  Top 0.254: 22.19,7.79 S1.3
  Bottom 0.178: v9.8,7.8 v20.76,7.8
UPDI_2  (via drill 0.3)
  Top 0.178: U10.P$6 71.61,4.3 | 71.61,4.3 R40.2 | S10.3 72.74,6.6 71.56,5.41 71.56,4.36 71.61,4.3 | S10.3 S10.2 81.71,7.79 84.1,10.18 TP22.P$1 | J10.1 59.02,8.91 v60.13,7.8 | v71.24,7.8 S10.3
  Bottom 0.178: v60.13,7.8 v71.24,7.8
UPDI_3  (via drill 0.3)
  Top 0.178: S3.3 123.23,6.6 122.04,5.41 122.04,4.3 | R12.2 122.2,4.3 122.04,4.3 | U3.P$6 122.04,4.3 | S3.3 S3.2 132.51,7.79 134.58,9.86 TP19.P$1 | J3.1 105.69,9.07 v106.96,7.8 | v121.72,7.8 v121.73,7.79 S3.3
  Bottom 0.178: v106.96,7.8 v121.72,7.8
UPDI_4  (via drill 0.3)
  Top 0.178: U4.P$6 172.42,4.3 R16.2 172.36,4.36 172.36,5.41 173.55,6.6 S4.3 | S4.3 S4.2 182.52,7.79 184.91,10.18 TP16.P$1 | J4.1 156.01,9.07 v157.28,7.8 | v172.05,7.8 S4.3
  Bottom 0.178: v157.28,7.8 v172.05,7.8
UPDI_5  (via drill 0.3)
  Top 0.178: U5.P$6 222.85,4.3 | 222.85,4.3 222.9,4.3 R20.2 | 222.85,4.3 222.85,5.41 224.03,6.6 S5.3 | S5.3 S5.2 233,7.79 235.39,10.18 TP13.P$1 | S5.3 v222.53,7.8 | v207.77,7.8 206.5,9.07 J5.1
  Bottom 0.178: v222.53,7.8 v207.77,7.8
UPDI_6  (via drill 0.3)
  Top 0.178: U6.P$6 273.39,4.3 R24.2 273.33,4.36 273.33,5.41 274.52,6.6 274.52,7.64 | 274.52,7.64 S6.3 S6.2 283.33,7.79 285.87,10.34 TP10.P$1 | J6.1 256.98,9.07 v258.25,7.8 | v273.01,7.8 274.36,7.8 274.52,7.64
  Bottom 0.178: v258.25,7.8 v273.01,7.8
UPDI_7  (via drill 0.3)
  Top 0.178: U7.P$6 323.87,4.3 R28.2 323.81,4.36 323.81,5.41 325,6.6 S7.3 | S7.3 S7.2 333.33,7.79 336.35,10.81 TP7.P$1 | S7.3 v323.49,7.8 | v308.73,7.8 307.46,9.07 J7.1
  Bottom 0.178: v323.49,7.8 v308.73,7.8
UPDI_8  (via drill 0.3)
  Top 0.178: U8.P$6 374.19,4.3 R32.2 374.14,4.36 374.14,5.41 375.32,6.6 S8.3 | S8.3 S8.2 383.82,7.79 386.68,10.65 TP4.P$1 | S8.3 v373.82,7.79 | v359.06,7.79 357.78,9.07 J8.1
  Bottom 0.178: v373.82,7.79 v359.06,7.79
UPDI_9  (via drill 0.3)
  Top 0.178: S9.3 431.13,7.79 S9.2 435.09,7.79 436.37,9.07 436.44,9.15 437.16,9.86 TP28.P$1 | S9.3 425.8,6.6 424.62,5.41 424.62,4.36 R36.2 424.67,4.3 U9.P$6 | J9.1 408.27,9.07 v409.54,7.8 | v424.3,7.8 S9.3
  Bottom 0.178: v409.54,7.8 v424.3,7.8
UPDI_10  (via drill 0.3)
  Top 0.178: 476.37,7.79 S2.2 482.88,7.79 484.15,9.07 484.15,10.97 TP1.P$1 | 476.37,7.79 S2.3 v474.79,7.79 v474.78,7.8 | U2.P$6 475.11,4.3 R8.2 475.1,4.32 475.1,5.41 476.37,6.68 476.37,7.79 | J2.1 463.79,8.47 v464.46,7.8
  Bottom 0.178: v464.46,7.8 v474.78,7.8
VCC  (via drill 0.3)
  Top 0.254: C1.1 12.5,9.22 | 12.5,9.22 v12.5,15.73 | U1.P$1 12.5,6.84 12.5,9.22 | C10.1 62.99,9.38 | 62.99,9.38 v62.99,17 | U10.P$1 62.99,6.84 62.99,9.38 | C3.1 113.47,9.22 | 113.47,9.22 v113.47,17 | U3.P$1 113.47,6.84 113.47,9.22 | C4.1 163.79,9.38 | 163.79,9.38 v163.79,15.73 | U4.P$1 163.79,6.84 163.79,9.38 | C5.1 214.27,9.22 | 214.27,9.22 v214.27,17 | U5.P$1 214.27,6.84 214.27,9.22 | C6.1 264.76,9.22 | 264.76,9.22 v264.76,17 | U6.P$1 264.76,6.84 264.76,9.22 | C7.1 315.24,9.22 | 315.24,9.22 v315.24,17 | U7.P$1 315.24,6.84 315.24,9.22 | C8.1 365.56,9.22 | 365.56,9.22 v365.56,17 | U8.P$1 365.56,6.84 365.56,9.22 | C9.1 416.05,9.22 | 416.05,9.22 v416.05,17 | U9.P$1 416.05,6.84 416.05,9.22 | C2.1 466.53,9.22 | 466.53,9.22 v466.53,17 | U2.P$1 466.53,6.84 466.53,9.22
  Top 0.406: S1.4 28.06,11.29 | 28.06,11.29 S1.1 | S3.4 S3.1 130.93,11.29 132.04,12.4 TP20.P$1 v132.04,17 | S4.4 S4.1 181.25,11.29 182.37,12.4 TP17.P$1 v182.37,17 | S5.4 S5.1 231.73,11.29 231.74,11.29 232.85,12.4 TP14.P$1 v232.85,17 | S6.4 S6.1 282.22,11.29 283.33,12.4 TP11.P$1 v283.33,17 | S7.4 S7.1 332.71,11.29 333.81,12.4 TP8.P$1 v333.81,17 | S8.4 S8.1 383.03,11.29 384.14,12.4 TP5.P$1 v384.14,17 | S9.4 S9.1 433.51,11.29 434.62,12.4 TP29.P$1 v434.62,17 | S10.4 S10.1 80.45,11.29 81.56,12.4 TP23.P$1 v81.56,17 | 28.06,11.29 29.97,11.29 31.08,12.4 TP26.P$1 v31.08,17 | S2.4 S2.1 482.88,11.29 485.1,13.51 TP2.P$1 v485.1,17
  Bottom 0.406: 342.23,14.46 344.77,17 | 136.49,17 136.49,13.19
  other vias: 342.7,11.77 342.7,10.34 342.7,8.91 342.7,7.48 136.8,11.77 136.8,10.34 136.8,8.91 136.8,7.48
  pour Top: 135.69,12.72 135.69,6.37 137.92,6.37 137.92,12.72
  pour Top: 341.59,12.72 341.59,6.37 343.81,6.37 343.81,12.72
  pour Bottom: -1.94,16.05 2.5,16.05 arc-90 3.77,14.78 3.77,13.51 arc180 5.68,13.51 5.68,14.78 arc-74 6.63,16.05 arc-47 9.17,15.73 arc-42 10.44,14.15 arc125 12.34,13.83 arc-58 15.84,15.42 arc-23 18.06,14.78 arc92 19.96,15.42 arc-76 21.87,16.37 arc18 29.17,16.05 arc-34 35.84,14.78 arc68 41.55,15.42 arc-95 44.09,15.1 arc110 46,15.1 arc-56 47.9,16.05 arc3 52.98,16.05 arc-3 53.94,16.05 arc-59 55.52,15.1 arc-43 55.66,14.15 arc207 57.39,14.15 arc-52 57.75,15.73 arc-59 59.33,16.37 arc8 63.78,16.05 arc12 66.95,16.37 arc-44 70.45,15.73 arc85 73.94,16.37 arc-69 74.89,16.69 arc17 79.65,16.05 arc24 83.78,17 arc-58 88.23,16.69 arc19 93.94,14.15 arc66 99.66,16.05 arc-119 101.88,15.73 arc-28 102.2,13.51 arc148 103.78,12.88 arc38 104.1,13.83 arc-33 104.74,16.05 arc-78 106.64,16.69 arc-17 109.5,15.1 arc75 112.99,15.1 arc-50 115.85,15.73 arc-28 118.39,14.46 arc93 121.56,14.78 arc-76 126.64,16.05 arc20 129.18,15.42 arc40 131.41,16.05 arc-95 134.58,15.42 arc132 137.12,15.73 arc-79 138.07,16.37 arc-32 141.25,15.1 arc83 146.65,15.42 arc-76 152.04,16.05 arc-50 152.68,15.1 arc-17 152.68,13.51 arc175 154.27,13.19 arc28 154.27,14.46 arc-71 154.9,16.05 arc-88 158.08,15.42 arc88 159.66,15.1 arc-37 160.93,15.42 arc-62 163.16,13.83 arc148 165.7,14.15 arc-82 167.6,15.73 arc-16 171.41,15.1 arc72 174.27,16.05 arc-81 175.54,16.37 arc49 185.06,16.05 arc-68 189.83,15.1 arc109 193.64,15.73 arc-75 194.27,16.05 arc-68 194.91,15.42 arc158 196.18,15.42 arc-68 197.13,16.37 arc-28 202.84,16.05 arc-92 203.16,15.42 arc52 203.43,13.01 arc169 204.75,13.67 arc-42 204.75,15.73 arc-71 205.7,16.37 arc-25 208.24,15.73 arc45 212.69,15.42 arc-11 215.54,16.05 arc-59 219.35,14.46 arc141 223.16,15.73 arc-146 225.39,16.37 arc103 228.56,16.05 arc-75 230.78,16.37 arc34 236.5,15.1 arc16 240.94,16.05 arc-72 243.17,15.42 arc118 245.71,15.73 arc-65 246.66,16.37 arc-3 252.37,16.37 arc-71 253.64,15.42 arc-35 253.64,13.83 arc215 255.31,13.83 arc-49 255.55,15.73 arc-49 256.5,16.37 arc-49 259.99,15.42 arc48 262.22,14.78 arc46 263.8,15.73 arc-108 265.07,15.73 arc108 266.34,15.73 arc-71 268.25,16.37 arc-37 270.47,14.78 arc108 273.33,14.78 arc-87 276.82,15.42 arc66 280.63,15.42 arc-66 286.98,15.42 arc21 290.79,13.83 arc77 293.33,15.1 arc-108 294.92,15.42 arc62 296.51,15.1 arc13 297.78,15.73 arc-60 303.49,16.05 arc-59 304.13,15.1 arc-9 304.13,13.51 arc166 305.71,13.19 arc37 305.71,15.1 arc-90 306.35,16.37 arc-47 309.84,16.05 arc-32 311.75,14.15 arc122 313.65,14.15 arc-60 315.24,15.1 arc-55 316.51,14.46 arc108 318.41,14.46 arc-51 321.91,16.37 arc-19 327.62,15.73 arc-50 330.16,13.51 arc149 332.38,13.83 arc-86 334.29,15.42 arc29 337.46,16.05 arc-51 343.5,16.05 arc29 346.67,15.42 arc15 351.75,16.37 arc-110 354.29,14.46 arc4 354.29,13.51 arc102 355.56,12.56 arc84 356.2,13.51 arc-45 356.83,16.05 arc-107 360.64,16.05 arc67 364.13,14.78 arc-15 365.95,14.98 arc-51 367.88,14.02 arc141 368.45,14.21 arc-104 371.75,16.69 arc-16 373.98,15.73 arc77 376.52,16.05 arc-110 378.42,15.73 arc80 381.91,14.15 arc29 384.14,15.42 arc-120 386.36,14.78 arc115 388.26,14.15 arc-29 392.39,16.05 arc-31 395.88,15.73 arc53 399.06,16.05 arc-57 403.82,16.37 arc-69 404.77,14.78 arc7 404.77,13.83 arc130 406.63,13.09 arc41 406.68,13.19 arc-4 407,15.42 arc-82 408.58,16.69 arc-43 411.44,15.42 arc63 413.98,14.78 arc36 416.2,16.37 arc-91 418.43,16.69 arc59 420.65,16.37 arc-67 425.09,15.42 arc113 426.68,15.73 arc-136 428.9,15.73 arc112 433.35,14.78 arc-60 437.16,15.73 arc-30 438.75,14.78 arc83 450.49,13.83 arc-41 459.07,16.37 arc-82 460.34,15.1 arc-8 460.34,13.51 arc165 461.97,13.19 arc21 462.24,15.1 arc-79 463.19,16.37 arc-71 466.37,15.1 arc126 469.54,15.42 arc-84 470.81,16.05 arc-42 472.08,15.1 arc107 475.89,14.78 arc-63 480.02,16.05 arc-15 483.2,14.78 arc58 485.1,14.78 arc-15 488.28,16.05 arc-17 494.31,16.69 494.63,16.69 494.63,20.81 -1.94,20.81
  pour Bottom: 337.46,16.05 338.42,16.37 arc-104 340.32,15.1 arc-4 340.64,7.16 arc151 344.48,6.2 arc32 344.77,7.48 arc-14 345.17,13.91 arc-69 346.67,15.42 arc69 347.62,16.37 arc111 346.04,17.96 arc-21 338.42,17.96 arc148
  pour Bottom: 132.84,17.16 133.8,16.31 arc-49 134.9,13.83 arc1 134.9,7.05 arc147 138.35,6.06 arc37 138.55,6.84 arc-15 139.03,14.94 arc-128 140.77,15.42 arc97 144.58,15.42 arc136 143.79,17 arc-11

### Text on the board
Bottom: R.REHRIG | v1.1 Feb 2020
tPlace: GND | VCC | VCC | GND
bPlace: 10 PEGS
Reference: DATA_IN | DATA_OUT | GND | VCC | VCC | GND